# Altium schematic sheet Filters.SchDoc
size A4
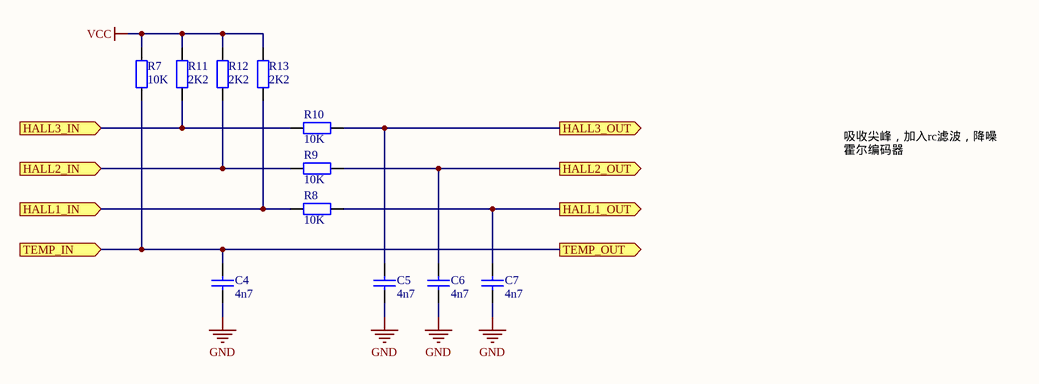
[diagram p0: Filters.SchDoc]

## Parts
C4  value 4n7  [0402]  (hidden comment: CAP)
C5  value 4n7  [0402]  (hidden comment: CAP)
C6  value 4n7  [0402]  (hidden comment: CAP)
C7  value 4n7  [0402]  (hidden comment: CAP)
R7  value 10K  [0402]  (hidden comment: Res1)
R8  value 10K  [0402]  (hidden comment: Res1)
R9  value 10K  [0402]  (hidden comment: Res1)
R10  value 10K  [0402]  (hidden comment: Res1)
R11  value 2K2  [0402]  (hidden comment: Res1)
R12  value 2K2  [0402]  (hidden comment: Res1)
R13  value 2K2  [0402]  (hidden comment: Res1)

## Ports
HALL1_IN (in), HALL1_OUT (out), HALL2_IN (in), HALL2_OUT (out), HALL3_IN (in), HALL3_OUT (out), TEMP_IN (in), TEMP_OUT (out)

## Nets
GND: C4.1 C5.1 C6.1 C7.1
VCC: R7.1 R11.1 R12.1 R13.1
HALL1_IN: R8.1 R13.2 ; port HALL1_IN
HALL1_OUT: C7.2 R8.2 ; port HALL1_OUT
HALL2_IN: R9.1 R12.2 ; port HALL2_IN
HALL2_OUT: C6.2 R9.2 ; port HALL2_OUT
HALL3_IN: R10.1 R11.2 ; port HALL3_IN
HALL3_OUT: C5.2 R10.2 ; port HALL3_OUT
TEMP_IN: C4.2 R7.2 ; port TEMP_IN, port TEMP_OUT

## Notes on the sheet
- 吸收尖峰，加入rc滤波，降噪
  霍尔编码器

## Library data of the parts
C4-C7 = CAP: Capacitor; Published: 8-Jun-2000; Revision: July-2002: Re-released for DXP Platform.; Publisher: Altium Limited
R7-R13 = Res1: 贴片电阻; Published: 8-Jun-2000; LatestRevisionDate: 17-Jul-2002; LatestRevisionNote: Re-released for DXP Platform.; PackageReference: AXIAL-0.4; Publisher: Altium Limited